# EAGLE schematic Schematic (EAGLE 9.7.0)
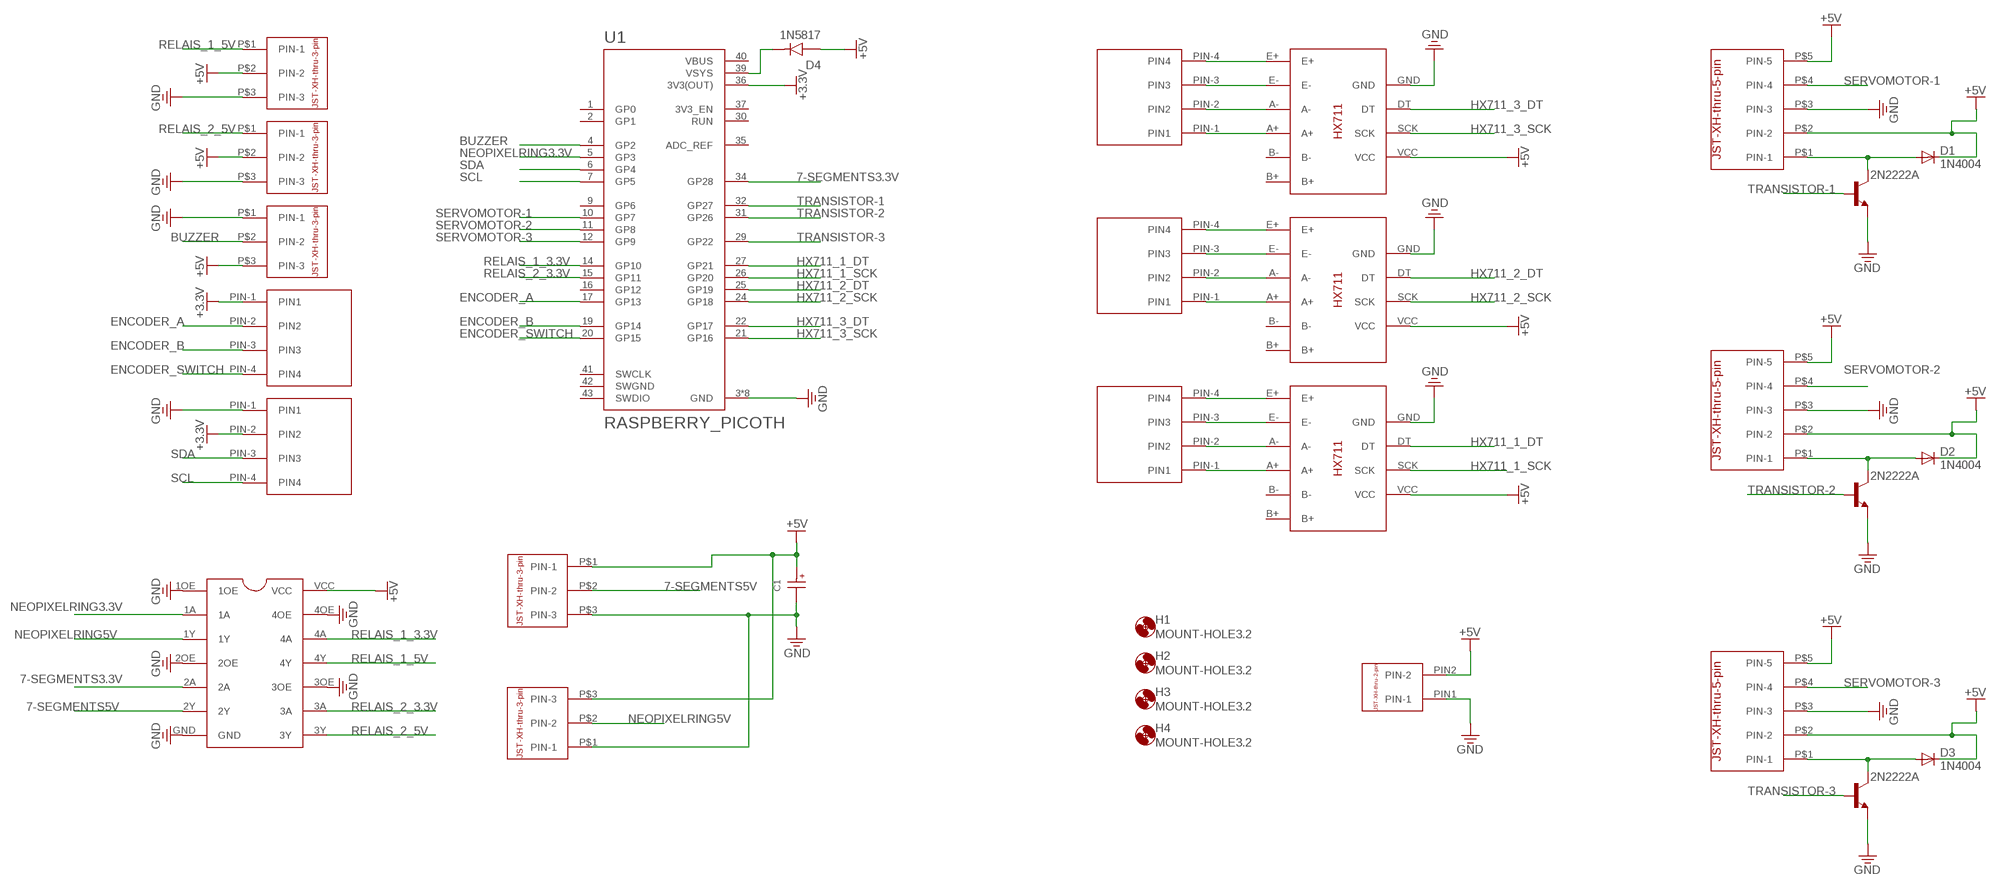
[diagram p0: schematic, sheet 1]

## Parts
7-SEGMENTS  JST-XH-THRU-3-PIN  [JST-XH-THRU-3-PIN-FOOTPRINT]
BUZZER  JST-XH-THRU-3-PIN  [JST-XH-THRU-3-PIN-FOOTPRINT]
C1  1200 µF  WCAP-ATG8_10X16_860010275017  [WCAP-ATG8_10X16(DXL)]
D1  1N4004  [DO41-10]
D2  1N4004  [DO41-10]
D3  1N4004  [DO41-10]
D4  1N5817  [DIOAD1036W78L470D235]
ENCODER  JST-XH-THRU-4-PIN  [JST-XH-THRU-4-PIN-PACKAGE]
H1  MOUNT-HOLE3.2  [3,2]
H2  MOUNT-HOLE3.2  [3,2]
H3  MOUNT-HOLE3.2  [3,2]
H4  MOUNT-HOLE3.2  [3,2]
HX711-1  JST-XH-THRU-4-PIN  [JST-XH-THRU-4-PIN-PACKAGE]
HX711-2  JST-XH-THRU-4-PIN  [JST-XH-THRU-4-PIN-PACKAGE]
HX711-3  JST-XH-THRU-4-PIN  [JST-XH-THRU-4-PIN-PACKAGE]
LDC_DISPLAY  JST-XH-THRU-4-PIN  [JST-XH-THRU-4-PIN-PACKAGE]
MAINS-ELECTRICS  JAS-XH-THRU-2-PIN  [JST-XH-TRHU-2-PIN-FOOTPRINT]
NEOPIXELRING  JST-XH-THRU-3-PIN  [JST-XH-THRU-3-PIN-FOOTPRINT]
RELAIS-1  JST-XH-THRU-3-PIN  [JST-XH-THRU-3-PIN-FOOTPRINT]
RELAIS-2  JST-XH-THRU-3-PIN  [JST-XH-THRU-3-PIN-FOOTPRINT]
SERVO-1  JST-XH-THRU-5-PIN  [JST-XH-THRU-5-PIN-FOOTPIRINT]
SERVO-2  JST-XH-THRU-5-PIN  [JST-XH-THRU-5-PIN-FOOTPIRINT]
SERVO-3  JST-XH-THRU-5-PIN  [JST-XH-THRU-5-PIN-FOOTPIRINT]
U1  RASPBERRY_PICOTH  [PICO-PKG-TH]
U$2  SN74HCT125N  [SN74HCT125N]
U$7  2N2222A  [2N2222A-FOOTPRINT]
U$8  HX711-AMPLIFIER  [HX711-FOOTPRINT]
U$9  HX711-AMPLIFIER  [HX711-FOOTPRINT]
U$10  HX711-AMPLIFIER  [HX711-FOOTPRINT]
U$12  2N2222A  [2N2222A-FOOTPRINT]
U$15  2N2222A  [2N2222A-FOOTPRINT]

## Nets
7-SEGMENTS3.3V: U1.34(GP28) U$2.2A
7-SEGMENTS5V: 7-SEGMENTS.P$2(PIN-2) U$2.2Y
+3.3V: ENCODER.PIN-1(PIN1) LDC_DISPLAY.PIN-2(PIN2) U1.36(3V3(OUT))
+5V: 7-SEGMENTS.P$1(PIN-1) BUZZER.P$3(PIN-3) C1.1(+) D1.C D2.C D3.C D4.A MAINS-ELECTRICS.PIN2(PIN-2) NEOPIXELRING.P$3(PIN-3) RELAIS-1.P$2(PIN-2) RELAIS-2.P$2(PIN-2) SERVO-1.P$2(PIN-2) SERVO-1.P$5(PIN-5) SERVO-2.P$2(PIN-2) SERVO-2.P$5(PIN-5) SERVO-3.P$2(PIN-2) SERVO-3.P$5(PIN-5) U$2.VCC U$8.VCC U$9.VCC U$10.VCC
BUZZER: BUZZER.P$2(PIN-2) U1.4(GP2)
ENCODER_A: ENCODER.PIN-2(PIN2) U1.17(GP13)
ENCODER_B: ENCODER.PIN-3(PIN3) U1.19(GP14)
ENCODER_SWITCH: ENCODER.PIN-4(PIN4) U1.20(GP15)
GND: 7-SEGMENTS.P$3(PIN-3) BUZZER.P$1(PIN-1) C1.2(-) LDC_DISPLAY.PIN-1(PIN1) MAINS-ELECTRICS.PIN1(PIN-1) NEOPIXELRING.P$1(PIN-1) RELAIS-1.P$3(PIN-3) RELAIS-2.P$3(PIN-3) SERVO-1.P$3(PIN-3) SERVO-2.P$3(PIN-3) SERVO-3.P$3(PIN-3) U1.3(GND) U1.8(GND) U1.13(GND) U1.18(GND) U1.23(GND) U1.28(GND) U1.33(GND) U1.38(GND) U$2.1OE U$2.2OE U$2.3OE U$2.4OE U$2.GND U$7.EMITTER(E) U$8.GND U$9.GND U$10.GND U$12.EMITTER(E) U$15.EMITTER(E)
HX711_1_DT: U1.27(GP21) U$10.DT
HX711_1_SCK: U1.26(GP20) U$10.SCK
HX711_2_DT: U1.25(GP19) U$9.DT
HX711_2_SCK: U1.24(GP18) U$9.SCK
HX711_3_DT: U1.22(GP17) U$8.DT
HX711_3_SCK: U1.21(GP16) U$8.SCK
N$1: HX711-1.PIN-4(PIN4) U$8.E+
N$2: HX711-1.PIN-3(PIN3) U$8.E-
N$3: HX711-1.PIN-2(PIN2) U$8.A-
N$4: HX711-1.PIN-1(PIN1) U$8.A+
N$5: HX711-2.PIN-4(PIN4) U$9.E+
N$6: HX711-2.PIN-3(PIN3) U$9.E-
N$7: HX711-2.PIN-2(PIN2) U$9.A-
N$8: HX711-2.PIN-1(PIN1) U$9.A+
N$9: HX711-3.PIN-4(PIN4) U$10.E+
N$10: HX711-3.PIN-3(PIN3) U$10.E-
N$11: HX711-3.PIN-2(PIN2) U$10.A-
N$12: HX711-3.PIN-1(PIN1) U$10.A+
N$14: D2.A SERVO-2.P$1(PIN-1) U$7.COLECTOR(C)
N$15: D3.A SERVO-3.P$1(PIN-1) U$12.COLECTOR(C)
N$16: D1.A SERVO-1.P$1(PIN-1) U$15.COLECTOR(C)
N$18: D4.C(K) U1.39(VSYS)
NEOPIXELRING3.3V: U1.5(GP3) U$2.1A
NEOPIXELRING5V: NEOPIXELRING.P$2(PIN-2) U$2.1Y
RELAIS_1_3.3V: U1.14(GP10) U$2.4A
RELAIS_1_5V: RELAIS-2.P$1(PIN-1) U$2.4Y
RELAIS_2_3.3V: U1.15(GP11) U$2.3A
RELAIS_2_5V: RELAIS-1.P$1(PIN-1) U$2.3Y
SCL: LDC_DISPLAY.PIN-4(PIN4) U1.7(GP5)
SDA: LDC_DISPLAY.PIN-3(PIN3) U1.6(GP4)
SERVOMOTOR-1: SERVO-1.P$4(PIN-4) U1.10(GP7)
SERVOMOTOR-2: SERVO-2.P$4(PIN-4) U1.11(GP8)
SERVOMOTOR-3: SERVO-3.P$4(PIN-4) U1.12(GP9)
TRANSISTOR-1: U1.32(GP27) U$15.BASE(B)
TRANSISTOR-2: U1.31(GP26) U$7.BASE(B)
TRANSISTOR-3: U1.29(GP22) U$12.BASE(B)
Unconnected: U1.1(GP0) U1.2(GP1) U1.9(GP6) U1.16(GP12) U1.30(RUN) U1.35(ADC_REF) U1.37(3V3_EN) U1.41(SWCLK) U1.43(SWDIO) U$8.B+ U$8.B- U$9.B+ U$9.B- U$10.B+ U$10.B-

## Power pins joined to a net without a drawn wire
SWGND: U1.42(SWGND)
VBUS: U1.40(VBUS)

## Library data of the parts
7-SEGMENTS BUZZER NEOPIXELRING RELAIS-1 RELAIS-2 = Korn weighing machine:JST-XH-THRU-3-PIN
C1 = Wurth_Capacitors_WCAP-ATG8:WCAP-ATG8_10X16: WCAP-ATG8 Aluminium Electrolytic Capacitors General Purpose +85 °C Characteristics General purpose product series with max. operating temperature of +85 °C Wide range of capacitance value Mounting style: THT Radial Capacitance range: 0.1 µF ‒ 33000 µF Capacitance tolerance: ±20 % Voltage range (UR): 10 ‒ 400 V(DC) Operating temperature: -40 °C up to +85 °C for UR < 400 V(DC) -25 °C up to +85 °C for UR ≥ 400 V(DC) Endurance: 2000 h @ +85 °C Dimensions (DxL) in mm: 5.0 x 11.0 up to 22.0 x 51.0 Recommended soldering: Wave soldering Applications Filtering Smoothing Energy storage Coupling <https://www.we-online.com/catalog/media/o35732v209%20WCAP-ATG8_4C.jpg> Details see: https://www.we-online.com/catalog/en/WCAP-ATG8/ Updated by yingchun,Shan;2020-02-27 2020(C) Würth Elektronik
D1-D3 = adafruit:1N4004: DIODE General purpose 1N400x type rectifier (With bigger pads) http://www.ladyada.net/library/pcb/eaglelibrary.html
D4 = Rectifier Schottky 1N5817:1N5817
ENCODER HX711-1-HX711-3 LDC_DISPLAY = Korn weighing machine:JST-XH-THRU-4-PIN
H1-H4 = holes:MOUNT-HOLE: MOUNTING HOLE with drill center marker
MAINS-ELECTRICS = Korn weighing machine:JAS-XH-THRU-2-PIN
SERVO-1-SERVO-3 = Korn weighing machine:JST-XH-THRU-5-PIN
U1 = RpiPico:RASPBERRY_PICO: Raspberry Pi Pico
U$2 = Maxis:SN74HCT125N
U$7 U$12 U$15 = Korn weighing machine:2N2222A
U$8-U$10 = Korn weighing machine:HX711-AMPLIFIER